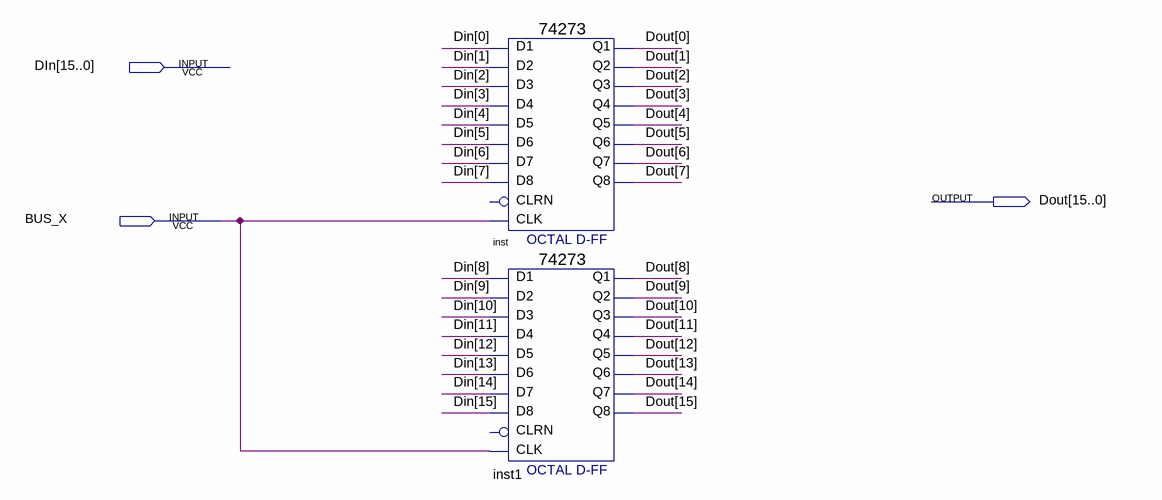
[diagram p0: schematic sheet]
// Quartus schematic IBUS_X.bdf as structural Verilog: 2 symbols, 3 pins
module IBUS_X (
  input  [15:0] DIn,
  input  BUS_X,
  output [15:0] Dout
);

  \74273  inst (
    .D2(DIn[1]), .D3(DIn[2]), .D1(DIn[0]), .D4(DIn[3]), .D7(DIn[6]), .D6(DIn[5]), .D5(DIn[4]), .D8(DIn[7]),
    .CLK(BUS_X), .Q4(Dout[3]), .Q1(Dout[0]), .Q2(Dout[1]), .Q3(Dout[2]), .Q6(Dout[5]), .Q5(Dout[4]),
    .Q7(Dout[6]), .Q8(Dout[7]));  // open: CLRN
  \74273  inst1 (
    .D2(DIn[9]), .D3(DIn[10]), .D1(DIn[8]), .D4(DIn[11]), .D7(DIn[14]), .D6(DIn[13]), .D5(DIn[12]),
    .D8(DIn[15]), .CLK(BUS_X), .Q4(Dout[11]), .Q1(Dout[8]), .Q2(Dout[9]), .Q3(Dout[10]), .Q6(Dout[13]),
    .Q5(Dout[12]), .Q7(Dout[14]), .Q8(Dout[15]));  // open: CLRN
endmodule
